# EAGLE schematic LiDAR (EAGLE 9.4.2)
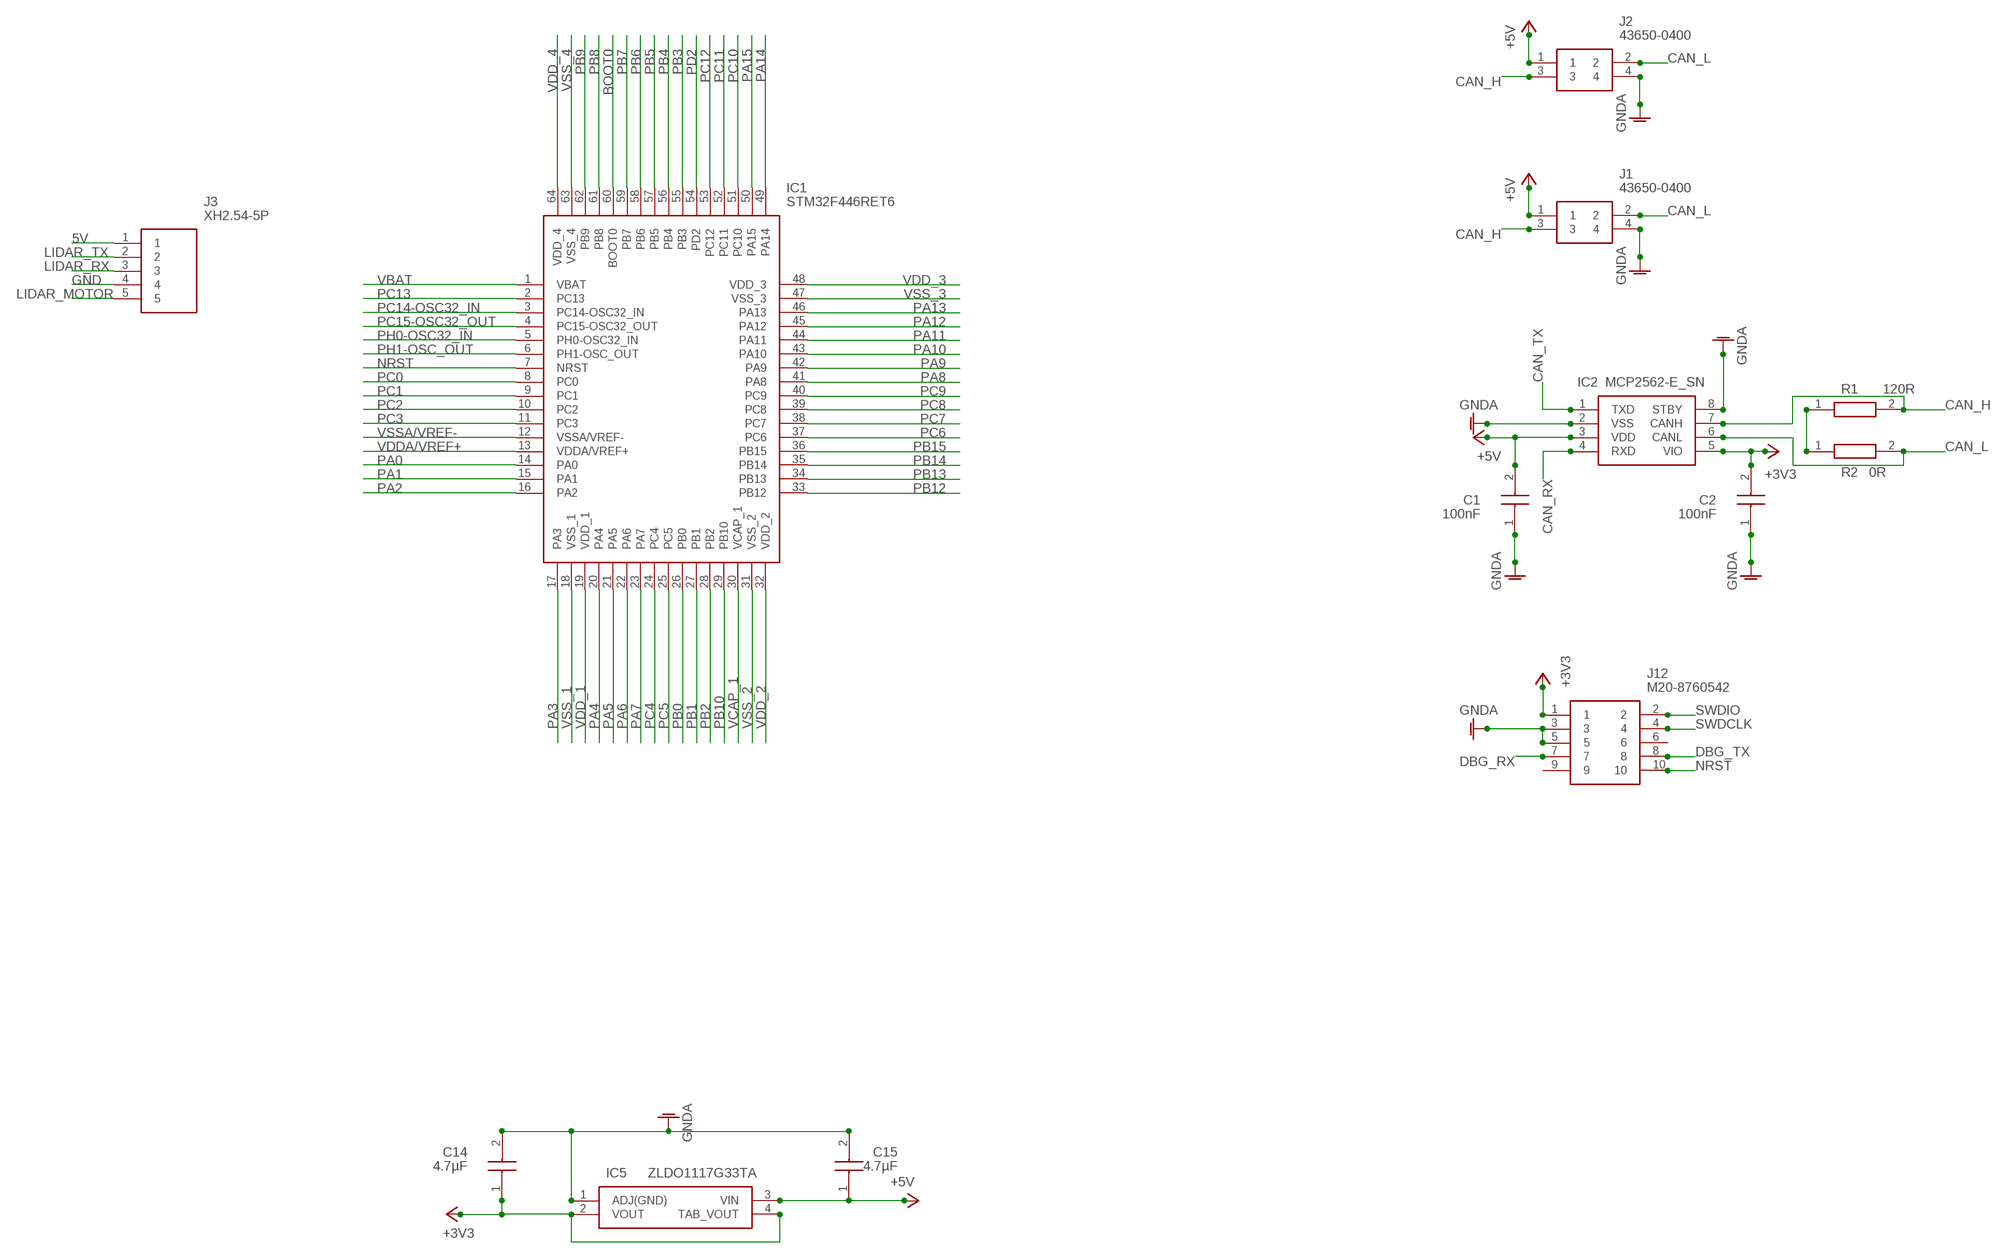
[diagram p0: schematic, sheet 1]

## Parts
C1  100nF  06035C104K4T2A  [CAPC1608X90N]
C2  100nF  06035C104K4T2A  [CAPC1608X90N]
C14  4.7µF  GRM21BR61E475KA12L  [CAPC2012X145N]
C15  4.7µF  GRM21BR61E475KA12L  [CAPC2012X145N]
IC1  STM32F446RET6  [QFP50P1200X1200X160-64N]
IC2  MCP2562-E_SN  [SOIC127P600X175-8N]
IC5  ZLDO1117G33TA  [SOT230P700X180-4N]
J1  43650-0400  [436500400]
J2  43650-0400  [436500400]
J3  XH2.54-5P  [SHDR5W64P0X250_1X5_1490X575X70]
J12  M20-8760542  [M208760542]
R1  120R  CRCW0603120RFKEA  [RESC1608X50N]
R2  0R  RK73Z1JTTDB  [RESC1608X55N]

## Nets
5V: J3.1
+3V3: C2.2 C14.1 IC2.5(VIO) IC5.2(VOUT) IC5.4(TAB_VOUT) J12.1
+5V: C1.2 C15.1 IC2.3(VDD) IC5.3(VIN) J1.1 J2.1
BOOT0: IC1.60(BOOT0)
CAN_H: IC2.7(CANH) J1.3 J2.3 R1.2
CAN_L: IC2.6(CANL) J1.2 J2.2 R2.2
CAN_RX: IC2.4(RXD)
CAN_TX: IC2.1(TXD)
DBG_RX: J12.7
DBG_TX: J12.8
GND: J3.4
GNDA: C1.1 C2.1 C14.2 C15.2 IC2.2(VSS) IC2.8(STBY) IC5.1(ADJ(GND)) J1.4 J2.4 J12.3 J12.5
LIDAR_MOTOR: J3.5
LIDAR_RX: J3.3
LIDAR_TX: J3.2
N$35: R1.1 R2.1
NRST: IC1.7(NRST) J12.10
PA0: IC1.14(PA0)
PA1: IC1.15(PA1)
PA2: IC1.16(PA2)
PA3: IC1.17(PA3)
PA4: IC1.20(PA4)
PA5: IC1.21(PA5)
PA6: IC1.22(PA6)
PA7: IC1.23(PA7)
PA8: IC1.41(PA8)
PA9: IC1.42(PA9)
PA10: IC1.43(PA10)
PA11: IC1.44(PA11)
PA12: IC1.45(PA12)
PA13: IC1.46(PA13)
PA14: IC1.49(PA14)
PA15: IC1.50(PA15)
PB0: IC1.26(PB0)
PB1: IC1.27(PB1)
PB2: IC1.28(PB2)
PB3: IC1.55(PB3)
PB4: IC1.56(PB4)
PB5: IC1.57(PB5)
PB6: IC1.58(PB6)
PB7: IC1.59(PB7)
PB8: IC1.61(PB8)
PB9: IC1.62(PB9)
PB10: IC1.29(PB10)
PB12: IC1.33(PB12)
PB13: IC1.34(PB13)
PB14: IC1.35(PB14)
PB15: IC1.36(PB15)
PC0: IC1.8(PC0)
PC1: IC1.9(PC1)
PC2: IC1.10(PC2)
PC3: IC1.11(PC3)
PC4: IC1.24(PC4)
PC5: IC1.25(PC5)
PC6: IC1.37(PC6)
PC7: IC1.38(PC7)
PC8: IC1.39(PC8)
PC9: IC1.40(PC9)
PC10: IC1.51(PC10)
PC11: IC1.52(PC11)
PC12: IC1.53(PC12)
PC13: IC1.2(PC13)
PC14-OSC32_IN: IC1.3(PC14-OSC32_IN)
PC15-OSC32_OUT: IC1.4(PC15-OSC32_OUT)
PD2: IC1.54(PD2)
PH0-OSC32_IN: IC1.5(PH0-OSC32_IN)
PH1-OSC_OUT: IC1.6(PH1-OSC_OUT)
SWDCLK: J12.4
SWDIO: J12.2
VBAT: IC1.1(VBAT)
VCAP_1: IC1.30(VCAP_1)
VDD_1: IC1.19(VDD_1)
VDD_2: IC1.32(VDD_2)
VDD_3: IC1.48(VDD_3)
VDD_4: IC1.64(VDD_4)
VDDA/VREF+: IC1.13(VDDA/VREF+)
VSS_1: IC1.18(VSS_1)
VSS_2: IC1.31(VSS_2)
VSS_3: IC1.47(VSS_3)
VSS_4: IC1.63(VSS_4)
VSSA/VREF-: IC1.12(VSSA/VREF-)
Unconnected: J12.6 J12.9

## Library data of the parts
C1 C2 = OUTech:06035C104K4T2A: Condo 100nF Source: Datasheet <http://www.mouser.com/catalog/supplier/library/pdf/AVXSurfaceMountCeramic.pdf>; ALLIED_NUMBER: 70474421; ALLIED_PRICE-STOCK: https://www.alliedelec.com/avx-06035c104k4t2a/70474421/; DESCRIPTION: AVX 100nF +/-10% 50 V dc X7R Dielectric SMD Ceramic Multilayer Capacitor 0603; HEIGHT: 0.9mm; MANUFACTURER_NAME: AVX; MANUFACTURER_PART_NUMBER: 06035C104K4T2A; MOUSER_PART_NUMBER: 581-06035C104K4; MOUSER_PRICE-STOCK: https://www.mouser.com/Search/Refine.aspx?Keyword=581-06035C104K4; RS_PART_NUMBER: 6983251P; RS_PRICE-STOCK: http://uk.rs-online.com/web/p/products/6983251P
C14 C15 = OUTech:GRM21BR61E475KA12L: CONDO 4.7 µF Source: Datasheet <http://www.murata.com/~/media/webrenewal/support/library/catalog/products/capacitor/mlcc/c02e.pdf>; DESCRIPTION: MURATA - GRM21BR61E475KA12L - CAP, MLCC, X5R, 4.7UF, 25V, 0805; HEIGHT: 1.45mm; MANUFACTURER_NAME: Murata Electronics; MANUFACTURER_PART_NUMBER: GRM21BR61E475KA12L; MOUSER_PART_NUMBER: 81-GRM21BR61E475KA12; MOUSER_PRICE-STOCK: https://www.mouser.com/Search/Refine.aspx?Keyword=81-GRM21BR61E475KA12; RS_PART_NUMBER: 7236057; RS_PRICE-STOCK: https://uk.rs-online.com/web/p/products/7236057
IC1 = OUTech:STM32F446RET6: 32-Bit MCU+DSP 512K Flash 180MHz LQFP64 STMicroelectronics STM32F446RET6, 32bit ARM Cortex M4 MCU, 180MHz, 512 kB Flash, 64-Pin LQFP Source: Datasheet <http://docs-emea.rs-online.com/webdocs/14d7/0900766b814d7c59.pdf>; DESCRIPTION: 32-Bit MCU+DSP 512K Flash 180MHz LQFP64 STMicroelectronics STM32F446RET6, 32bit ARM Cortex M4 MCU, 180MHz, 512 kB Flash, 64-Pin LQFP; HEIGHT: 1.6mm; MANUFACTURER_NAME: STMicroelectronics; MANUFACTURER_PART_NUMBER: STM32F446RET6; MOUSER_PART_NUMBER: 511-STM32F446RET6; MOUSER_PRICE-STOCK: https://www.mouser.com/Search/Refine.aspx?Keyword=511-STM32F446RET6; RS_PART_NUMBER: 1106621P; RS_PRICE-STOCK: http://uk.rs-online.com/web/p/products/1106621P
IC2 = OUTech:MCP2562-E_SN: CAN Transceiver Source: Datasheet <http://docs-emea.rs-online.com/webdocs/12a8/0900766b812a88df.pdf>; ALLIED_NUMBER: 70415107; ALLIED_PRICE-STOCK: http://www.alliedelec.com/microchip-technology-inc-mcp2562-e-sn/70415107/; DESCRIPTION: CAN Transceiver 1Mbps 5V 125degC SOIC8 CAN Transceiver 1MBps IEC 61000-4-2 Standby-Mode 8pins SOIC; HEIGHT: 1.75mm; MANUFACTURER_NAME: Microchip; MANUFACTURER_PART_NUMBER: MCP2562-E/SN; MOUSER_PART_NUMBER: 579-MCP2562-E/SN; MOUSER_PRICE-STOCK: https://www.mouser.com/Search/Refine.aspx?Keyword=579-MCP2562-E%2FSN; RS_PART_NUMBER: 7990228P; RS_PRICE-STOCK: http://uk.rs-online.com/web/p/products/7990228P
IC5 = OUTech:ZLDO1117G33TA: LDO Regulator Pos 3.3V 1A Source: Datasheet <http://docs-emea.rs-online.com/webdocs/13ed/0900766b813ed062.pdf>; ALLIED_NUMBER: 70438621; ALLIED_PRICE-STOCK: http://www.alliedelec.com/diodes-inc-zldo1117g33ta/70438621/; DESCRIPTION: LDO Regulator Pos 3.3V 1A 4Pin SOT223 Diodes Inc ZLDO1117G33TA, Single Linear Voltage Regulator, 1A 3.3 V, 2%, 3-Pin SOT-223; HEIGHT: 1.8mm; MANUFACTURER_NAME: Diodes Inc.; MANUFACTURER_PART_NUMBER: ZLDO1117G33TA; MOUSER_PART_NUMBER: 522-ZLDO1117G33TA; MOUSER_PRICE-STOCK: https://www.mouser.com/Search/Refine.aspx?Keyword=522-ZLDO1117G33TA; RS_PART_NUMBER: 7515183P; RS_PRICE-STOCK: http://uk.rs-online.com/web/p/products/7515183P
J1 J2 = OUTech:43650-0400: MOLEX 4 Pins Source: Datasheet <https://www.molex.com/pdm_docs/sd/436500400_sd.pdf>; ALLIED_NUMBER: 70266896; ALLIED_PRICE-STOCK: https://www.alliedelec.com/molex-incorporated-43650-0400/70266896/; DESCRIPTION: Molex MICRO-FIT 3.0 Series, Series Number 43650, 3mm Pitch 4 Way 1 Row Right Angle PCB Header, Solder Termination, 5A; HEIGHT: mm; MANUFACTURER_NAME: Molex; MANUFACTURER_PART_NUMBER: 43650-0400; MOUSER_PART_NUMBER: 538-43650-0400; MOUSER_PRICE-STOCK: https://www.mouser.com/Search/Refine.aspx?Keyword=538-43650-0400; RS_PART_NUMBER: 6704733P; RS_PRICE-STOCK: http://uk.rs-online.com/web/p/products/6704733P
J3 = OUTech:XH2.54-5P: XH connector, 5 way Source: Datasheet <http://www.jst-mfg.com/product/pdf/eng/eXH.pdf>; DESCRIPTION: JST 5PIN LIDAR; MANUFACTURER_PART_NUMBER: XH2.54-5P
J12 = OUTech:M20-8760542: PINHEADER 2x5 2.54mm Source: Datasheet <https://cdn.harwin.com/pdfs/M20-876.pdf>; ALLIED_NUMBER: R1052685; ALLIED_PRICE-STOCK: https://www.alliedelec.com/harwin-m20-8760542/R1052685/; DESCRIPTION: M20 Header, Smt, Dil, Vertical, 5+5 W HARWIN M20 Series, 2.54mm Pitch 10 Way 2 Row Straight Pin Header, Surface Mount, Solder Termination; HEIGHT: 8mm; MANUFACTURER_NAME: HARWIN; MANUFACTURER_PART_NUMBER: M20-8760542; MOUSER_PART_NUMBER: 855-M20-8760542; MOUSER_PRICE-STOCK: https://www.mouser.com/Search/Refine.aspx?Keyword=855-M20-8760542; RS_PART_NUMBER: 6812893P; RS_PRICE-STOCK: http://uk.rs-online.com/web/p/products/6812893P
R1 = OUTech:CRCW0603120RFKEA: R 120 OHM Source: Datasheet <http://www.vishay.com/docs/20035/dcrcwe3.pdf>; ALLIED_NUMBER: 70202999; ALLIED_PRICE-STOCK: https://www.alliedelec.com/vishay-dale-crcw0603120rfkea/70202999/; DESCRIPTION: Vishay CRCW Series Thick Film Surface Mount Resistor 0603 Case 120 +/-1% 0.1W +/-100ppm/C; HEIGHT: 0.5mm; MANUFACTURER_NAME: Vishay; MANUFACTURER_PART_NUMBER: CRCW0603120RFKEA; MOUSER_PART_NUMBER: 71-CRCW0603-120-E3; MOUSER_PRICE-STOCK: https://www.mouser.com/Search/Refine.aspx?Keyword=71-CRCW0603-120-E3; RS_PART_NUMBER: 6789718; RS_PRICE-STOCK: https://uk.rs-online.com/web/p/products/6789718
R2 = OUTech:RK73Z1JTTDB: Res 0 Ohm Source: Datasheet <http://static6.arrow.com/aropdfconversion/bc0756cd0a8dcf3d2a21f52543f9dcb6175ffe2d/rk73z.pdf>; DESCRIPTION: Res Thick Film 0603 0 Ohm Pad SMD Automotive T/R; HEIGHT: 0.55mm; MANUFACTURER_NAME: KOA Speer; MANUFACTURER_PART_NUMBER: RK73Z1JTTDB